# EAGLE design schema-projet-elec (EAGLE 9.6.2)
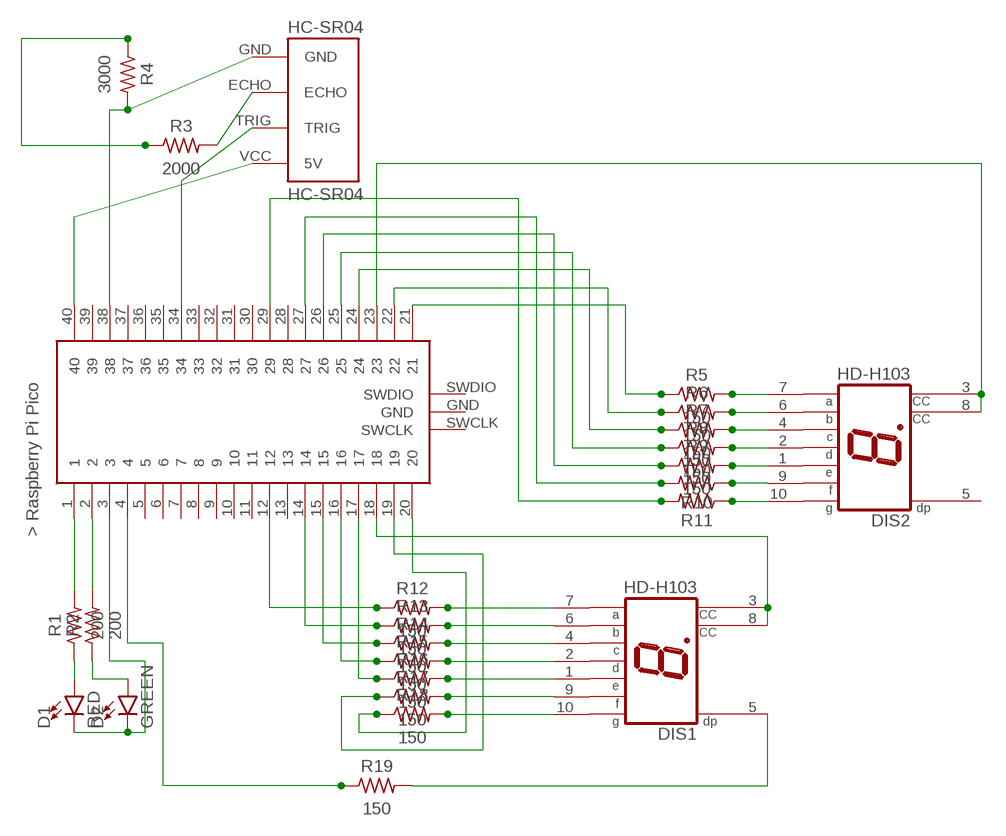
[diagram p0: schematic, sheet 1]

## Parts
D1  RED  LED-RED0603  [LED-0603]
D2  GREEN  LED-GREEN0603  [LED-0603]
DIS1  HD-H103  [HDSP-M]
DIS2  HD-H103  [HDSP-M]
HC-SR04  HC-SR04  [HC-SR04_FOOTPRINT]
R1  200  R-US_AXIAL-7.2MM-PITCH  [RESAD724W46L381D178B]
R2  200  R-US_AXIAL-7.2MM-PITCH  [RESAD724W46L381D178B]
R3  2000  R-US_AXIAL-7.2MM-PITCH  [RESAD724W46L381D178B]
R4  3000  R-US_AXIAL-7.2MM-PITCH  [RESAD724W46L381D178B]
R5  150  R-US_AXIAL-7.2MM-PITCH  [RESAD724W46L381D178B]
R6  150  R-US_AXIAL-7.2MM-PITCH  [RESAD724W46L381D178B]
R7  150  R-US_AXIAL-7.2MM-PITCH  [RESAD724W46L381D178B]
R8  150  R-US_AXIAL-7.2MM-PITCH  [RESAD724W46L381D178B]
R9  150  R-US_AXIAL-7.2MM-PITCH  [RESAD724W46L381D178B]
R10  150  R-US_AXIAL-7.2MM-PITCH  [RESAD724W46L381D178B]
R11  150  R-US_AXIAL-7.2MM-PITCH  [RESAD724W46L381D178B]
R12  150  R-US_AXIAL-7.2MM-PITCH  [RESAD724W46L381D178B]
R13  150  R-US_AXIAL-7.2MM-PITCH  [RESAD724W46L381D178B]
R14  150  R-US_AXIAL-7.2MM-PITCH  [RESAD724W46L381D178B]
R15  150  R-US_AXIAL-7.2MM-PITCH  [RESAD724W46L381D178B]
R16  150  R-US_AXIAL-7.2MM-PITCH  [RESAD724W46L381D178B]
R17  150  R-US_AXIAL-7.2MM-PITCH  [RESAD724W46L381D178B]
R18  150  R-US_AXIAL-7.2MM-PITCH  [RESAD724W46L381D178B]
R19  150  R-US_AXIAL-7.2MM-PITCH  [RESAD724W46L381D178B]
U$1  RASPBERRY-PI-PICO_TH  [FT_RASPBERRY-PI-PICO_TH]

## Nets
N$1: R1.2 U$1.1
N$2: D1.A R1.1
N$3: R2.2 U$1.2
N$4: D2.A R2.1
N$5: D1.C D2.C U$1.3
N$6: HC-SR04.VCC(5V) U$1.40
N$7: HC-SR04.GND R4.2 U$1.38
N$8: HC-SR04.ECHO R3.2
N$9: R3.1 R4.1
N$10: DIS2.7(A) R5.2
N$11: HC-SR04.TRIG U$1.34
N$12: DIS2.6(B) R6.2
N$13: DIS2.4(C) R7.2
N$14: DIS2.2(D) R8.2
N$15: DIS2.1(E) R9.2
N$16: DIS2.9(F) R10.1
N$17: DIS2.10(G) R11.1
N$18: R12.1 U$1.12
N$19: R13.1 U$1.14
N$20: R14.1 U$1.15
N$21: R16.1 U$1.17
N$22: R15.1 U$1.16
N$25: DIS1.10(G) R18.2
N$26: DIS1.9(F) R17.2
N$27: DIS1.1(E) R16.2
N$28: DIS1.2(D) R15.2
N$29: DIS1.4(C) R14.2
N$30: DIS1.6(B) R13.2
N$31: DIS1.7(A) R12.2
N$32: R11.2 U$1.29
N$33: R10.2 U$1.27
N$34: R9.1 U$1.26
N$35: R8.1 U$1.25
N$36: R7.1 U$1.24
N$37: R6.1 U$1.22
N$38: R5.1 U$1.21
N$39: R17.1 U$1.19
N$40: R19.1 U$1.4
N$41: DIS1.5(DP) R19.2
N$42: DIS1.3(CC) DIS1.8(CC) U$1.18
N$43: R18.1 U$1.20
N$44: DIS2.3(CC) DIS2.8(CC) U$1.23
Unconnected: DIS2.5(DP) U$1.5 U$1.6 U$1.7 U$1.8 U$1.9 U$1.10 U$1.11 U$1.13 U$1.28 U$1.30 U$1.31 U$1.32 U$1.33 U$1.35 U$1.36 U$1.37 U$1.39 U$1.GND U$1.SWCLK U$1.SWDIO

## Library data of the parts
D1 = SparkFun-LED:LED-RED: Red SMD LED Used in manufacturing of most products at SparkFun Packages: 0603 - SMD 0603 package [Product Link] <http://docs.avagotech.com/docs/AV02-0551EN> 0603 SMART - SMD 0603 SMART package ( more efficient and expensive)[Product Link] <http://www.osram-os.com/Graphics/XPic2/00077099_0.pdf> 1206 - SMD1206 package [Product Link] <https://www.sparkfun.com/datasheets/DevTools/LilyPad/Q150OVS4.pdff> SparkFun Products: Pro Mini 328 -5V <https://www.sparkfun.com/products/821> RedBoard <https://www.sparkfun.com/products/12757> IOIO-OTG <https://www.sparkfun.com/products/13613>; PROD_ID: DIO-00819
D2 = SparkFun-LED:LED-GREEN: Green SMD LED Used in manufacturing of various products at SparkFun Packages: 0603 - SMD 0603 package [Product Link] <http://www.futureelectronics.com/en/technologies/semiconductors/optoelectronics/leds/Pages/9894312-LTST-C190GKT.aspx?CrossPart=HSMG-C190&IM=0> LilyPad 1206 - SMD1206 LilyPad package [Product Link] <http://www.futureelectronics.com/en/Technologies/Product.aspx?ProductID=IN150NGHARVATEKCORPORATION2049943&IM=0> 1206 - SMD1206 package [Product Link] <http://www.futureelectronics.com/en/technologies/semiconductors/optoelectronics/leds/Pages/8315665-LTST-C150KGKT.aspx?IM=0> 1206 Bottom Mount -SMD 1206 Bottom Mount [Product Link] <http://www.digikey.com/product-detail/en/lite-on-inc/LTST-C230KGKT/160-1456-1-ND/386854> SparkFun Products: Pro Mini 328 -5V <https://www.sparkfun.com/products/821> RedBoard <https://www.sparkfun.com/products/12757> MP3 Trigger <https://www.sparkfun.com/products/13720> Makey Makey <https://www.sparkfun.com/products/11076>; PROD_ID: DIO-00821
DIS1 DIS2 = display-hp:HD-H103: LED DISPLAY 1-character 7 segment, decimal point right; OC_FARNELL: unknown; OC_NEWARK: unknown
HC-SR04 = hc-sr04:HC-SR04: Ultrasonic Sensor HC-SR04
R1-R19 = Resistor:R-US: Resistor Fixed - ANSI; CATEGORY: Resistor; SUB-CATEGORY: Fixed
U$1 = pipico:RASPBERRY-PI-PICO_TH: Raspberry Pi Pico microcontroller board for through-hole mounting.

## Board
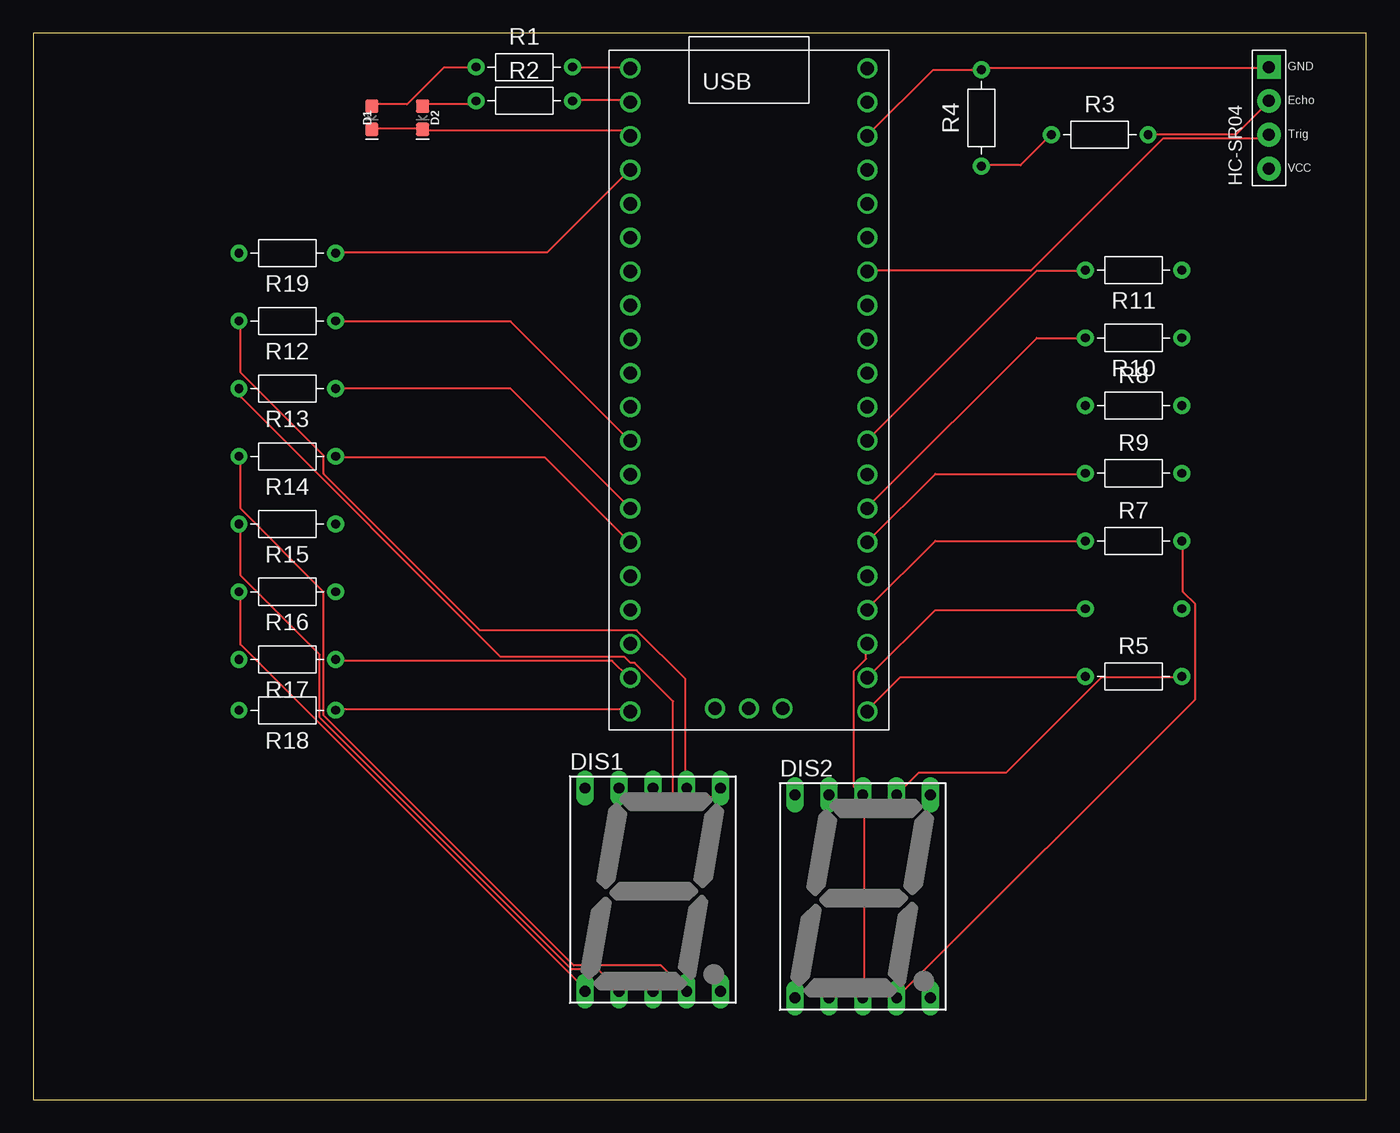
[diagram p1: board, top side]
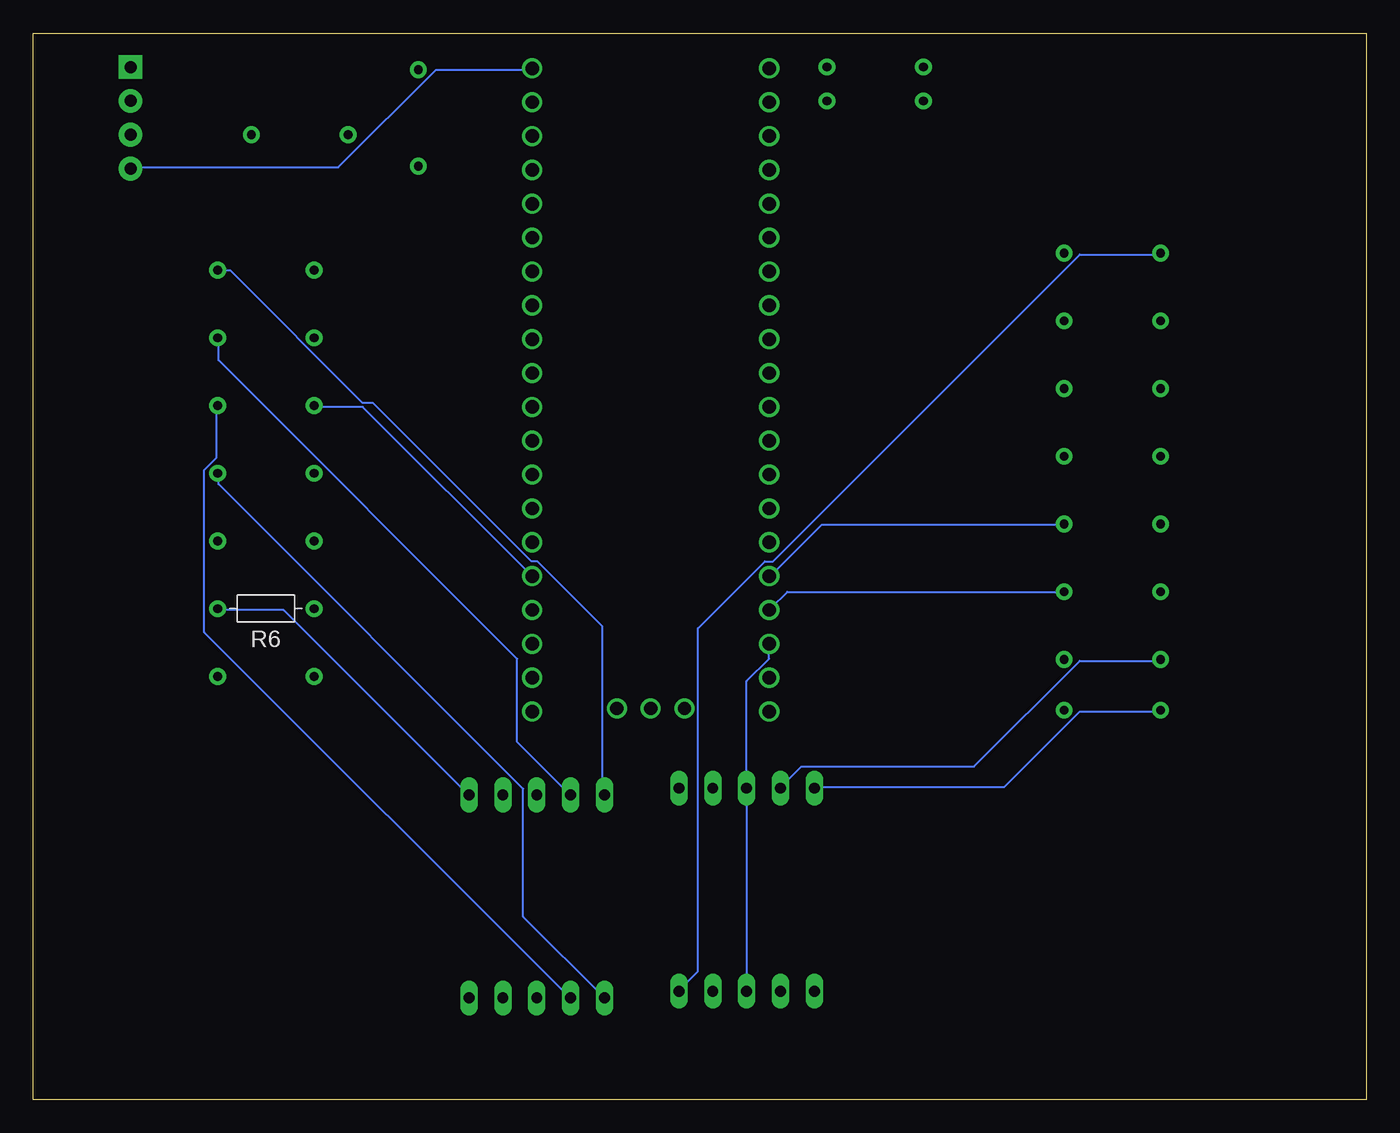
[diagram p2: board, bottom side, seen from below]

Size 100 x 80 mm. Coordinates in mm from the lower left corner, seen from the top.
Outline: 0,0 100,0 100,80 0,80 0,0
Copper layers (1*16): Top 0.035mm / dielectric 1.5mm / Bottom 0.035mm
Design rules "default": minimum track width 6mil, minimum drill 0.35mm, track to track 6mil, track to pad 6mil, pad to pad 6mil, via to via 6mil, smd to smd 6mil, copper to edge 40mil, drill to drill 6mil, minimum pad ring 10mil, minimum via ring 8mil, stop-mask expansion 4mil, vias tented up to drill 0mil, thermal gap 10mil

### Footprints (pad centres in the part's own frame; a part is rotated, then mirrored left to right if it is on the bottom)
LED-0603 = smd 1 x 1: A -0.877,0; C 0.877,0
HDSP-M = drill 0.813 long: 1 -5.08,-7.62; 2 -2.54,-7.62; 3 0,-7.62; 4 2.54,-7.62; 5 5.08,-7.62; 6 5.08,7.62; 7 2.54,7.62; 8 0,7.62; 9 -2.54,7.62; 10 -5.08,7.62
HC-SR04_FOOTPRINT = drill 0.9 pad 1.778: ECHO 0,1.27; TRIG 0,-1.27; VCC 0,-3.81 | drill 0.9 pad 1.778 square: GND 0,3.81
RESAD724W46L381D178B = drill 0.66 pad 1.26: 1 -3.62,0; 2 3.62,0
FT_RASPBERRY-PI-PICO_TH = drill 1: 1 -8.55,24.03; 2 -8.55,21.49; 3 -8.55,18.95; 4 -8.55,16.41; 5 -8.55,13.87; 6 -8.55,11.33; 7 -8.55,8.79; 8 -8.55,6.25; 9 -8.55,3.71; 10 -8.55,1.17; 11 -8.55,-1.37; 12 -8.55,-3.91; 13 -8.55,-6.45; 14 -8.55,-8.99; 15 -8.55,-11.53; 16 -8.55,-14.07; 17 -8.55,-16.61; 18 -8.55,-19.15; 19 -8.55,-21.69; 20 -8.55,-24.23; 21 9.23,-24.23; 22 9.23,-21.69; 23 9.23,-19.15; 24 9.23,-16.61; 25 9.23,-14.07; 26 9.23,-11.53; 27 9.23,-8.99; 28 9.23,-6.45; 29 9.23,-3.91; 30 9.23,-1.37; 31 9.23,1.17; 32 9.23,3.71; 33 9.23,6.25; 34 9.23,8.79; 35 9.23,11.33; 36 9.23,13.87; 37 9.23,16.41; 38 9.23,18.95; 39 9.23,21.49; 40 9.23,24.03; GND 0.34,-24; SWCLK -2.2,-24; SWDIO 2.88,-24

### Placement (x,y rotation side)
D1  25.4,73.66 270 top
D2  29.21,73.66 270 top
DIS1  46.48,15.75 0 top
DIS2  62.23,15.24 0 top
HC-SR04  92.71,73.66 0 top
R1  36.83,77.47 0 top
R2  36.83,74.93 0 top
R3  80.01,72.39 0 top
R4  71.12,73.66 90 top
R5  82.55,31.75 0 top
R6  82.55,36.83 180 bottom
R7  82.55,41.91 0 top
R8  82.55,52.07 0 top
R9  82.55,46.99 0 top
R10  82.55,57.15 180 top
R11  82.55,62.23 180 top
R12  19.05,58.42 180 top
R13  19.05,53.34 180 top
R14  19.05,48.26 180 top
R15  19.05,43.18 180 top
R16  19.05,38.1 180 top
R17  19.05,33.02 180 top
R18  19.05,29.21 180 top
R19  19.05,63.5 180 top
U$1  53.34,53.34 0 top

### Tracks (layer width: path | path; a pad name or v marks a point on that pad's centre or on a via)
N$1
  Top 0.152: R1.2 40.54,77.42 44.65,77.42 U$1.1
N$2
  Top 0.152: D1.A 25.45,74.68 28.04,74.68 30.79,77.42 33.07,77.42 R1.1
N$3
  Top 0.152: R2.2 40.54,74.98 44.65,74.98 U$1.2
N$4
  Top 0.152: D2.A 29.26,74.68 32.92,74.68 33.07,74.83 R2.1
N$5
  Top 0.152: D1.C 25.45,72.85 29.11,72.85 D2.C 29.26,72.69 44.35,72.69 44.65,72.39 U$1.3
N$6
  Bottom 0.152: U$1.40 62.64,77.27 69.8,77.27 77.11,69.95 92.66,69.95 HC-SR04.VCC
N$7
  Top 0.152: U$1.38 62.64,72.39 67.51,77.27 71.02,77.27 R4.2 71.17,77.42 92.66,77.42 HC-SR04.GND
N$8
  Top 0.152: R3.2 90.22,72.39 92.66,74.83 HC-SR04.ECHO
N$9
  Top 0.152: R4.1 71.17,70.1 74.07,70.1 76.35,72.39 R3.1
N$10
  Top 0.152: DIS2.7 66.45,24.54 73,24.54 80.16,31.7 86.11,31.7 R5.2
N$11
  Top 0.152: U$1.34 62.64,62.18 74.83,62.18 84.73,72.08 92.35,72.08 92.66,72.39 HC-SR04.TRIG
N$12
  Bottom 0.152: R6.2 86.11,36.73 81.23,36.73 67.36,22.86 DIS2.6
N$13
  Top 0.152: DIS2.4 87.17,30.02 87.17,37.19 86.26,38.1 86.26,41.91 R7.2
N$14
  Bottom 0.152: R8.2 86.26,51.97 86.26,48.16 87.17,47.24 87.17,35.05 59.74,7.62 DIS2.2
N$15
  Bottom 0.152: DIS2.1 63.25,13.72 63.25,23.32 86.11,46.18 86.11,46.94 R9.2
N$16
  Bottom 0.152: R10.1 86.11,57.15 86.11,55.47 63.7,33.07 63.7,26.82 59.74,22.86 DIS2.9
N$17
  Bottom 0.152: DIS2.10 57.3,23.01 57.3,35.51 62.18,40.39 62.64,40.39 74.52,52.27 75.29,52.27 85.19,62.18 86.11,62.18 R11.1
N$18
  Top 0.152: R12.1 22.71,58.37 35.81,58.37 44.65,49.53 U$1.12
N$19
  Top 0.152: R13.1 35.81,53.34 44.65,44.5 U$1.14
N$20
  Top 0.152: R14.1 22.71,48.16 38.41,48.16 44.65,41.91 U$1.15
N$21
  Bottom 0.152: R16.1 43.43,38.1 44.65,36.88 U$1.17
N$22
  Bottom 0.152: R15.1 22.71,43.13 40.84,43.13 44.65,39.32 U$1.16
N$25
  Bottom 0.152: R18.2 15.54,29.11 21.49,29.11 27.13,23.47 41.3,23.47 DIS1.10
N$26
  Bottom 0.152: R17.2 15.54,32.92 21.49,32.92 29.41,24.99 42.37,24.99 43.89,23.47 DIS1.9
N$27
  Top 0.152: R16.2 15.54,38.1 15.54,34.14 41.45,8.23 DIS1.1
N$28
  Top 0.152: R15.2 15.54,43.13 15.54,39.32 21.49,33.38 21.49,28.65 40.39,9.75 42.37,9.75 43.89,8.23 DIS1.2
N$29
  Top 0.152: DIS1.4 47.09,10.06 40.54,10.06 21.79,28.8 21.79,38.1 15.54,44.35 15.54,48.16 R14.2
N$30
  Top 0.152: DIS1.6 49.99,21.79 48.62,21.79 48.01,22.4 48.01,29.87 45.11,32.77 44.81,32.77 44.35,33.22 35.05,33.22 15.54,52.73 15.54,53.34 R13.2
N$31
  Top 0.152: R12.2 15.54,58.37 15.54,54.56 21.79,48.31 21.79,46.94 33.53,35.2 45.26,35.2 48.92,31.55 48.92,23.47 DIS1.7
N$32
  Top 0.152: R11.2 78.79,62.18 75.29,62.18 62.64,49.53 U$1.29
N$33
  Top 0.152: R10.2 75.29,57.15 62.64,44.5 U$1.27
N$34
  Top 0.152: R9.1 78.79,46.94 67.67,46.94 62.64,41.91 U$1.26
N$35
  Bottom 0.152: R8.1 78.79,51.97 75.29,51.97 62.64,39.32 U$1.25
N$36
  Top 0.152: R7.1 67.67,41.91 62.64,36.88 U$1.24
N$37
  Top 0.152: R6.1 78.79,36.73 67.67,36.73 62.64,31.7 U$1.22
N$38
  Top 0.152: R5.1 78.79,31.7 65.08,31.7 62.64,29.26 U$1.21
N$39
  Top 0.152: R17.1 22.71,32.92 43.43,32.92 44.65,31.7 U$1.19
N$40
  Top 0.152: R19.1 22.71,63.55 38.56,63.55 44.65,69.65 U$1.4
N$41
  Bottom 0.152: R19.2 15.54,63.4 21.49,63.4 44.5,40.39 45.11,40.39 50.14,35.36 50.14,9.6 51.51,8.23 DIS1.5
N$42
  Bottom 0.152: DIS1.3 DIS1.8 46.48,31.39 44.81,33.07 44.81,34.14 U$1.18
N$43
  Top 0.152: R18.1 22.71,29.26 44.65,29.26 U$1.20
N$44
  Top 0.152: DIS2.3 62.33,7.62 62.33,22.86 DIS2.8 62.18,22.86 61.57,23.47 61.57,32.16 62.48,33.07 62.48,34.14 U$1.23